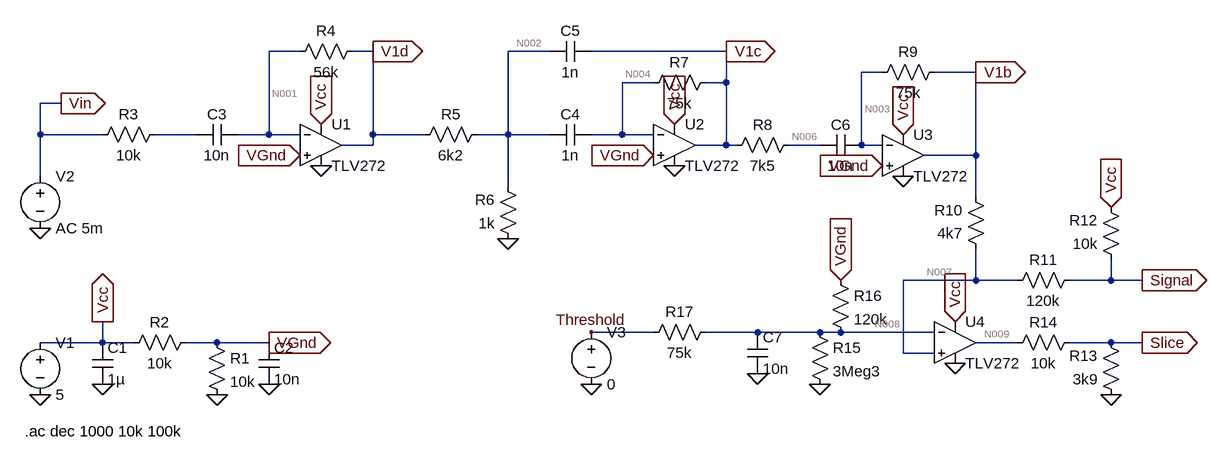
[diagram p0: schematic Lab5B2.asc]
* Lab5B2.asc
V1 Vcc 0 5
C1 Vcc 0 1µ
C2 VGnd 0 10n
R1 VGnd 0 10k
R2 VGnd Vcc 10k
V2 Vin 0 AC 5m
R3 N005 Vin 10k
C3 N001 N005 10n
R4 V1d N001 56k
R5 N002 V1d 6k2
* U1: TLV272 (symbol TLV272 not available, pins judged from their places): In+=VGnd In-=N001 V+=Vcc V-=0 OUT=V1d
* U2: TLV272 (symbol TLV272 not available, pins judged from their places): In+=VGnd In-=N004 V+=Vcc V-=0 OUT=V1c
* U3: TLV272 (symbol TLV272 not available, pins judged from their places): In+=VGnd In-=N003 V+=Vcc V-=0 OUT=V1b
* U4: TLV272 (symbol TLV272 not available, pins judged from their places): In+=N007 In-=N008 V+=Vcc V-=0 OUT=N009
R6 0 N002 1k
C4 N004 N002 1n
C5 V1c N002 1n
R7 V1c N004 75k
R8 N006 V1c 7k5
C6 N003 N006 10n
R9 V1b N003 75k
R10 N007 V1b 4k7
R11 Signal N007 120k
R12 Signal Vcc 10k
R13 0 Slice 3k9
R14 N009 Slice 10k
R15 N008 0 3Meg3
R16 VGnd N008 120k
R17 N008 Threshold 75k
C7 N008 0 10n
V3 Threshold 0 0
.ac dec 1000 10k 100k
.backanno
.end

* Results of the author's LTspice run, read from the files saved beside the schematic
* Operating Point, zero values left out:
*   V(vcc) = 5 V
*   V(vgnd) = 2.437 V
*   V(n001) = 2.437 V
*   V(v1d) = 2.437 V
*   V(n002) = 338.5 mV
*   V(v1c) = 2.437 V
*   V(n004) = 2.437 V
*   V(v1b) = 2.437 V
*   V(n003) = 2.437 V
*   V(n009) = 4.891 V
*   V(n008) = 924.5 mV
*   V(n007) = 2.526 V
*   V(n006) = 2.437 V
*   V(signal) = 4.81 V
*   V(slice) = 1.372 V
*   I(R17) = 12.33 µA
*   I(R16) = 12.6 µA
*   I(R15) = 280.2 nA
*   I(R14) = 351.9 µA
*   I(R13) = -351.9 µA
*   I(R12) = -19.03 µA
*   I(R11) = 19.03 µA
*   I(R10) = 19.03 µA
*   I(R9) = -126 pA
*   I(R7) = -126 pA
*   I(R6) = -338.5 µA
*   I(R5) = -338.5 µA
*   I(R4) = -126 pA
*   I(R2) = -256.3 µA
*   I(R1) = 243.7 µA
*   I(V3) = 12.33 µA
*   I(V1) = -1.56 mA
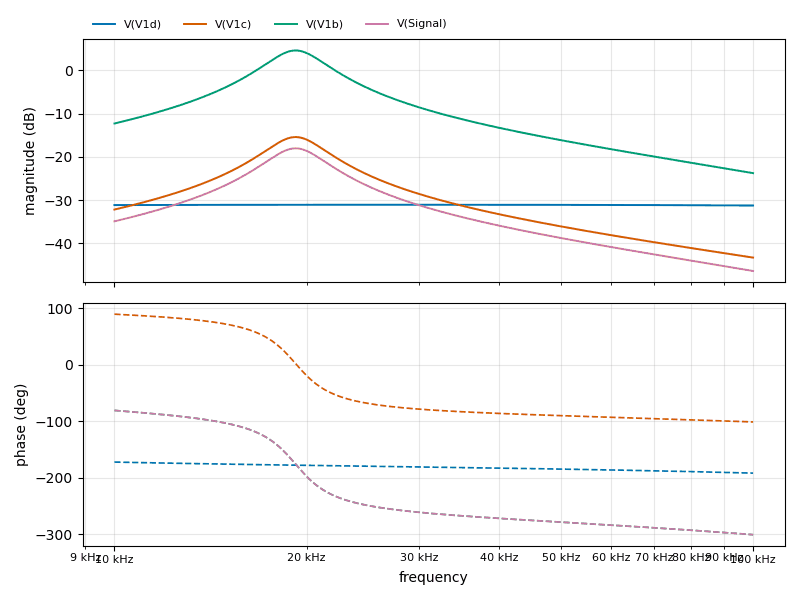
[diagram p1: AC Analysis of Lab5B2.asc, plotted from the saved traces]
* AC Analysis, 1 run:
*   V(V1d): -31.14 dB at 10 kHz, -31.24 dB at 100 kHz, peak -31.06 dB at 26.49 kHz
*   V(V1c): -32.17 dB at 10 kHz, -43.26 dB at 100 kHz, peak -15.44 dB at 19.23 kHz, 3 dB below the peak at 17.32 kHz and 21.31 kHz
*   V(V1b): -12.31 dB at 10 kHz, -23.77 dB at 100 kHz, peak 4.55 dB at 19.23 kHz, 3 dB below the peak at 17.32 kHz and 21.32 kHz
*   V(Signal): -34.90 dB at 10 kHz, -46.35 dB at 100 kHz, peak -18.04 dB at 19.23 kHz, 3 dB below the peak at 17.32 kHz and 21.32 kHz